# EAGLE design TSOC_USBUART2_test (EAGLE 6.6.0)
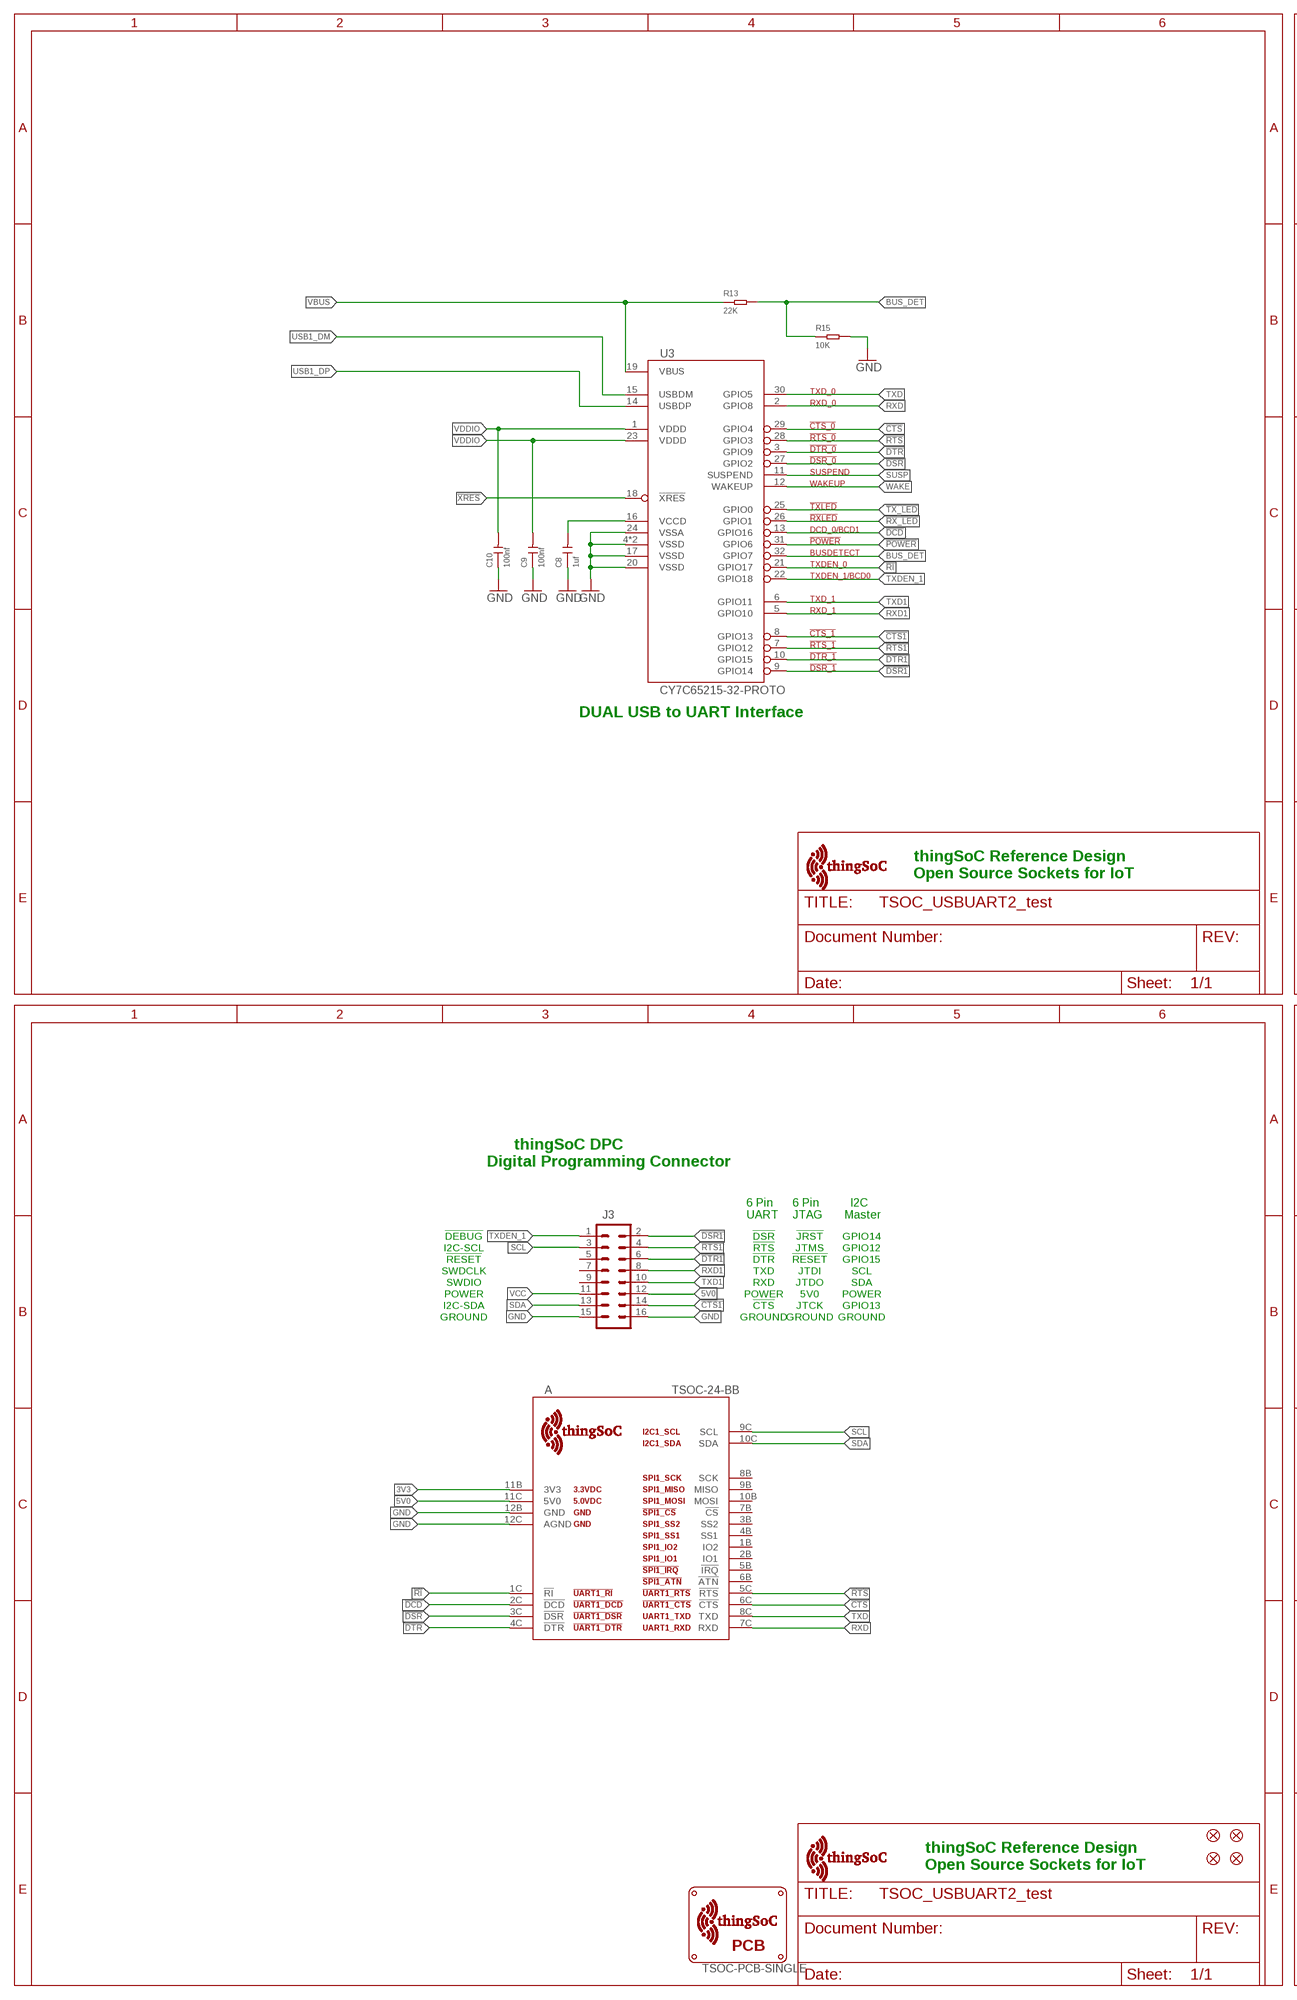
[diagram p0: schematic, sheet 1, part 1 of 2]
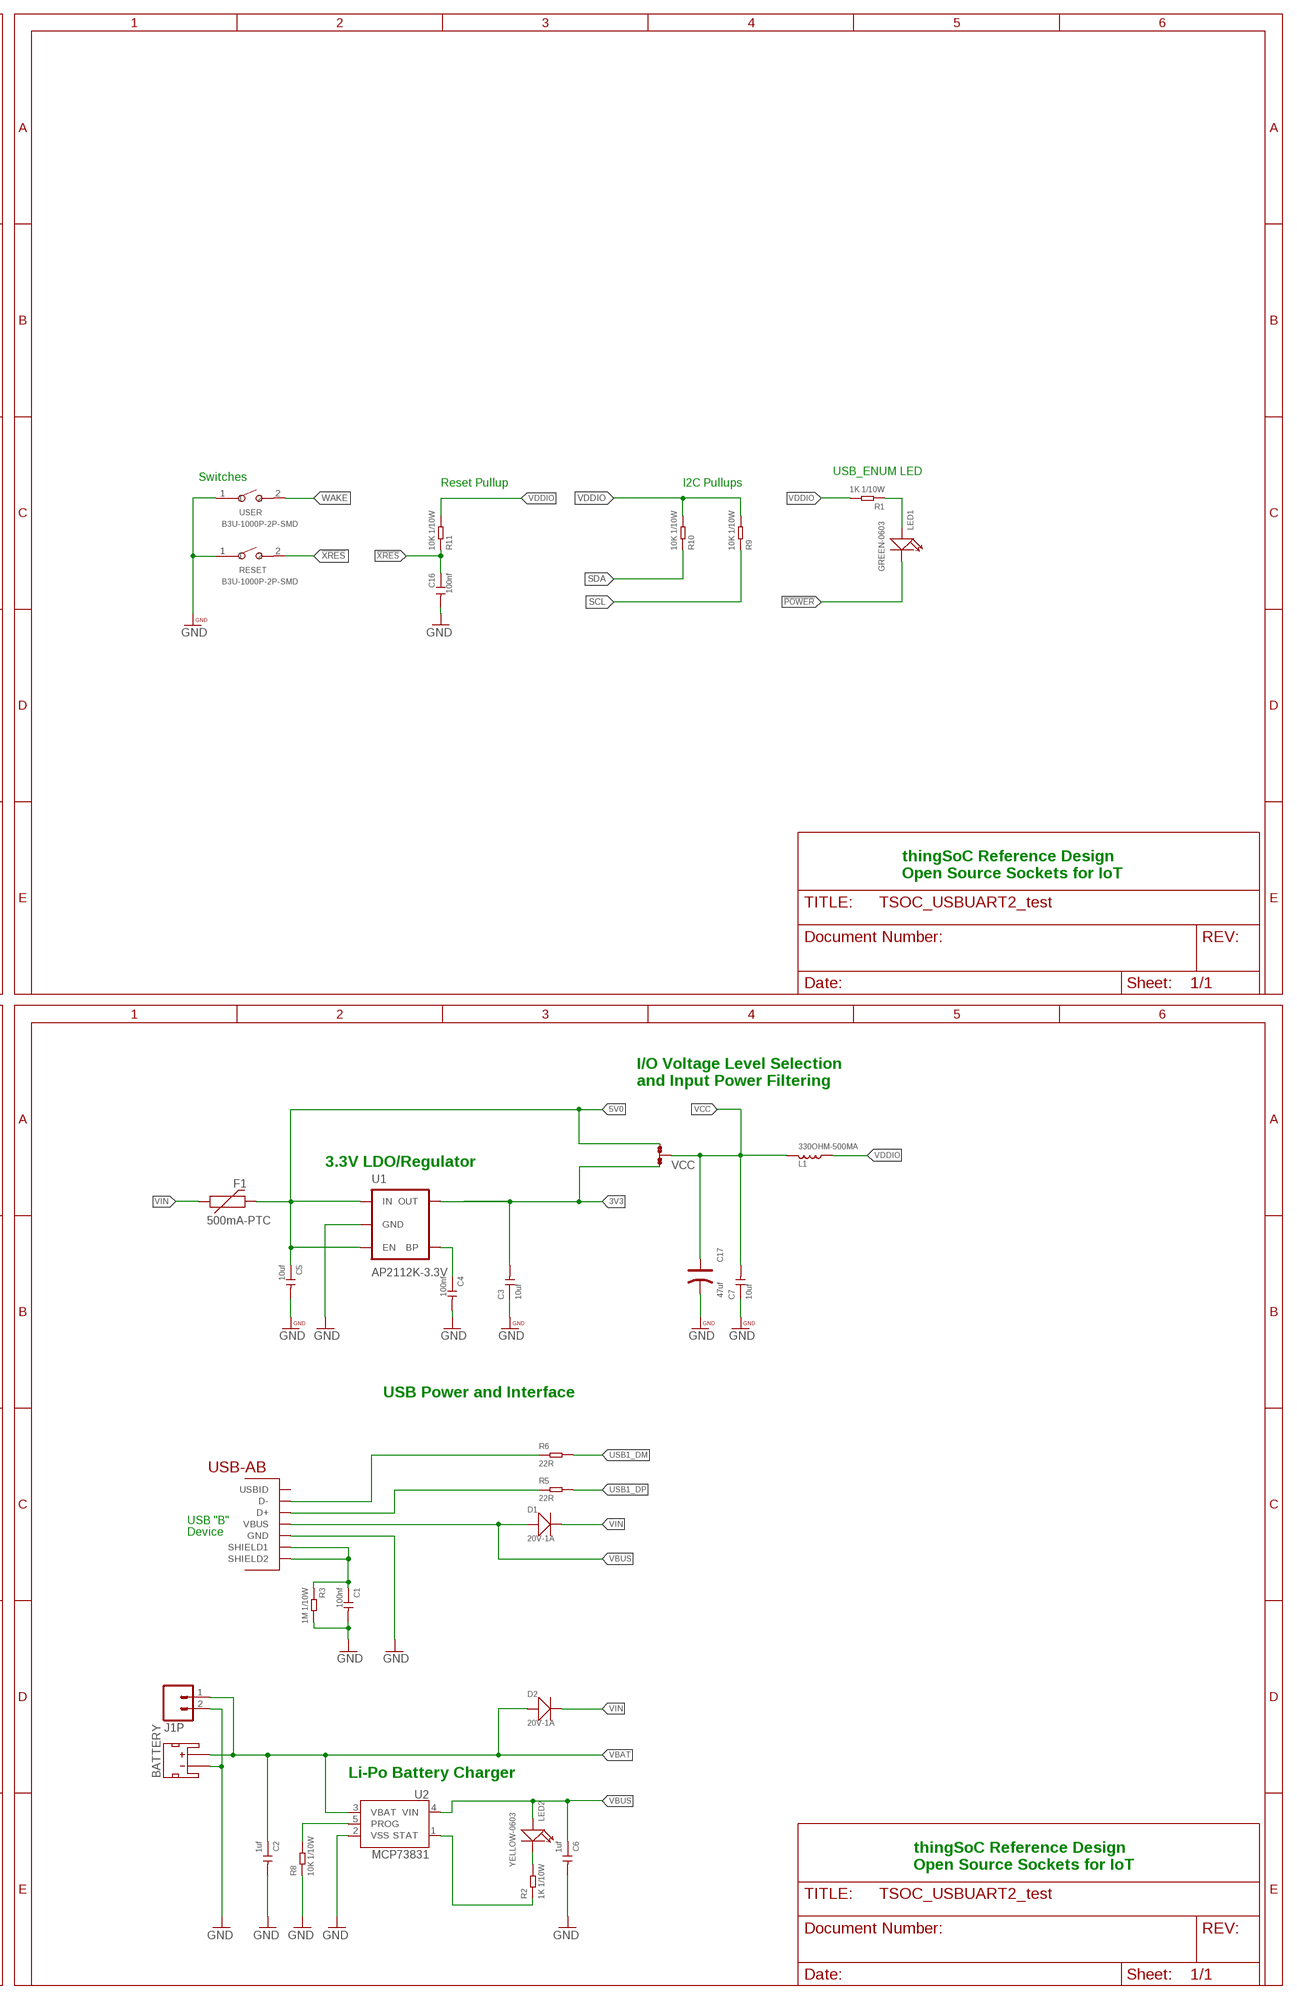
[diagram p1: schematic, sheet 1, part 2 of 2]

## Parts
A  TSOC-24-BB  [TSOC-BB-S24]
BATTERY  JST_2MM_MALE  [JST-2-SMD]
C1  100nf  CERAMIC-100NF-50V-10%-X7R(0603)  [C0603]
C2  1uf  CERAMIC-1UF-25V-10%-X7R(0603)  [C0603]
C3  10uf  CERAMIC-10UF-10V-10%-X5R(0603)  [C0603]
C4  100nf  CERAMIC-100NF-50V-10%-X7R(0603)  [C0603]
C5  10uf  CERAMIC-10UF-10V-10%-X5R(0603)  [C0603]
C6  1uf  CERAMIC-1UF-25V-10%-X7R(0603)  [C0603]
C7  10uf  CERAMIC-10UF-10V-10%-X5R(0603)  [C0603]
C8  1uf  CERAMIC-1UF-25V-10%-X7R(0603)  [C0603]
C9  100nf  CERAMIC-100NF-50V-10%-X7R(0603)  [C0603]
C10  100nf  CERAMIC-100NF-50V-10%-X7R(0603)  [C0603]
C16  100nf  CERAMIC-100NF-50V-10%-X7R(0603)  [C0603]
C17  47uf  TANTALUM-SMD-47UF-6.3V(AVX-A)  [AVX-A]
D1  20V-1A  SMD-DIODE-SCHOTTKY-20V-1A(SOD-123)  [SOD-123]
D2  20V-1A  SMD-DIODE-SCHOTTKY-20V-1A(SOD-123)  [SOD-123]
F1  500mA-PTC  PTCSMD  [PTC-1206]
FID1  FIDUCIALUFIDUCIAL  [MICRO-FIDUCIAL]
FID2  FIDUCIALUFIDUCIAL  [MICRO-FIDUCIAL]
FID3  FIDUCIALUFIDUCIAL  [MICRO-FIDUCIAL]
FID4  FIDUCIALUFIDUCIAL  [MICRO-FIDUCIAL]
J1P  M02-JST-2-PTH-NO_SILK  [JST-2-PTH-NS]
J3  M08X2  [2X8]
L1  330OHM-500MA  SMD-FERRITE-CHIP-120-OHM-500MA(0603)  [L0603]
LED1  GREEN-0603  SMD-LED-CLEAR-GREEN(0603)  [LED-0603]
LED2  YELLOW-0603  SMD-LED-CLEAR-YELLOW(0603)  [LED-0603]
R1  1K 1/10W  SMD-RES-1K-5%-1/10W(0603)  [R0603]
R2  1K 1/10W  SMD-RES-1K-5%-1/10W(0603)  [R0603]
R3  1M 1/10W  SMD-RES-1M-5%-1/10W(0603)  [R0603]
R5  22R  SMD-RES-22R-5%-1/10W(0603)  [R0603]
R6  22R  SMD-RES-22R-5%-1/10W(0603)  [R0603]
R8  10K 1/10W  SMD-RES-10K-5%-1/10W(0603)  [R0603]
R9  10K 1/10W  SMD-RES-10K-5%-1/10W(0603)  [R0603]
R10  10K 1/10W  SMD-RES-10K-5%-1/10W(0603)  [R0603]
R11  10K 1/10W  SMD-RES-10K-5%-1/10W(0603)  [R0603]
R13  22K  SMD-RES-22K-5%-1/10W(0603)  [R0603]
R15  10K  SMD-RES-10K-1%-1/10W(0603)  [R0603]
RESET  B3U-1000P-2P-SMD  SMD-BUTTON(2P-3.0X2.5X1.2+0.4MM)-B3U-1000P-2P-SMD  [SW2-2.6-3.0X2.5X1.2+0.4MM]
U1  AP2112K-3.3V  V_REG_LDOSMD  [SOT23-5]
U2  MCP73831  [SOT23-5]
U3  CY7C65215-32-PROTO  [QFN32-PROTO]
U$1  TSOC-PCB-SINGLE  [TSOC-BB-BRD-DIM]
U$100  TSOC-LOGO-LRG  [TSOC-LOGO-LRG]
U$101  TSOC-LOGO-SMALL  [TSOC-LOGO-SML]
USB  USB_AB  [USB-AB-MICRO-SMD]
USER  B3U-1000P-2P-SMD  SMD-BUTTON(2P-3.0X2.5X1.2+0.4MM)-B3U-1000P-2P-SMD  [SW2-2.6-3.0X2.5X1.2+0.4MM]
VCC  JMP-3-1_2  [JMP-3-1_2]

## Nets
3V3: A.11B(3V3) C3.2 U1.5(OUT) VCC.1
5V0: A.11C(5V0) C5.1 F1.2 J3.12 U1.1(IN) U1.3(EN) VCC.3
!CTS: A.6C(!CTS) U3.29(GPIO4)
!CTS1: J3.14 U3.8(GPIO13)
!DCD: A.2C(!DCD) U3.13(GPIO16)
!DSR: A.3C(!DSR) U3.27(GPIO2)
!DSR1: J3.2 U3.9(GPIO14)
!DTR: A.4C(!DTR) U3.3(GPIO9)
!DTR1: J3.6 U3.10(GPIO15)
!POWER: LED1.- U3.31(GPIO6)
!RI: A.1C(!RI) U3.21(GPIO17)
!RTS: A.5C(!RTS) U3.28(GPIO3)
!RTS1: J3.4 U3.7(GPIO12)
!RX_LED: U3.26(GPIO1)
!TX_LED: U3.25(GPIO0)
!XRES: C16.1 R11.1 RESET.2 U3.18(!XRES)
BUS_DET: R13.2 R15.1 U3.32(GPIO7)
BYPASS1: C4.1 U1.4(BP)
CLED: LED2.- R2.2
CSTAT: R2.1 U2.1(STAT)
GND: A.12B(GND) A.12C(AGND) BATTERY.1(-) C1.2 C2.2 C3.1 C4.2 C5.2 C6.2 C7.1 C8.1 C9.1 C10.1 C16.2 C17.- J1P.2 J3.15 J3.16 R3.2 R8.1 R15.2 RESET.1 U1.2(GND) U2.2(VSS) U3.4(VSSD) U3.17(VSSD) U3.20(VSSD) U3.24(VSSA) U3.EXP(VSSD) USB.GND USER.1
N$1: R8.2 U2.5(PROG)
N$17: LED1.+ R1.1
RXD: A.7C(RXD) U3.2(GPIO8)
RXD1: J3.8 U3.5(GPIO10)
SCL: A.9C(SCL) J3.3 R9.1
SDA: A.10C(SDA) J3.13 R10.1
SUSP: U3.11(SUSPEND)
TXD: A.8C(TXD) U3.30(GPIO5)
TXD1: J3.10 U3.6(GPIO11)
TXDEN_1: J3.1 U3.22(GPIO18)
USB1_DM: R6.2 U3.15(USBDM)
USB1_DP: R5.2 U3.14(USBDP)
USB1_M: R6.1 USB.D-
USB1_P: R5.1 USB.D+
USB1_SHIELD: C1.1 R3.1 USB.SHIELD1 USB.SHIELD2
VBAT: BATTERY.2(+) C2.1 D2.+ J1P.1 U2.3(VBAT)
VBUS: C6.1 D1.+ LED2.+ R13.1 U2.4(VIN) U3.19(VBUS) USB.VBUS
VCC: C7.2 C17.+ J3.11 L1.1 VCC.2
VCCD: C8.2 U3.16(VCCD)
VDDIO: C9.2 C10.2 L1.2 R1.2 R9.2 R10.2 R11.2 U3.1(VDDD) U3.23(VDDD)
VIN: D1.- D2.- F1.1
WAKE: U3.12(WAKEUP) USER.2
Unconnected: A.1B(IO2) A.2B(IO1) A.3B(SS2) A.4B(SS1) A.5B(!IRQ) A.6B(!ATN) A.7B(!CS) A.8B(SCK) A.9B(MISO) A.10B(MOSI) BATTERY.NC1(PAD1) BATTERY.NC2(PAD2) J3.5 J3.7 J3.9 USB.ID(USBID)

## Notes on the sheet
- USB_ENUM LED
- Switches
- Reset Pullup | I2C Pullups
- DUAL USB to UART Interface
- thingSoC Reference Design
  Open Source Sockets for IoT
- thingSoC Reference Design
  Open Source Sockets for IoT
- I/O Voltage Level Selection
  and Input Power Filtering
- thingSoC DPC
  Digital Programming Connector
- 3.3V LDO/Regulator
- 6 Pin
  UART
- 6 Pin
  JTAG
- I2C
  Master
- !DEBUG | !DSR | !JRST | GPIO14
- I2C-SCL | !RTS | JTMS | GPIO12
- !RESET | !DTR | !RESET | GPIO15
- SWDCLK | TXD | JTDI | SCL
- SWDIO | RXD | JTDO | SDA
- POWER | POWER | 5V0 | POWER
- I2C-SDA | !CTS | JTCK | GPIO13
- GROUND | GROUND | GROUND | GROUND
- USB Power and Interface
- USB "B"
- Device
- Li-Po Battery Charger
- thingSoC Reference Design
  Open Source Sockets for IoT
- thingSoC Reference Design
  Open Source Sockets for IoT

## Library data of the parts
A = thingSoC:TSOC-24: thingSoC Twenty-Four(24) Pin Socket Source LBR : http://www.thingsoc.com Github : https://github.com/thingsoc License : http://creativecommons.org/licenses/by-sa/4.0/ (Creative Commons 4.0) THIS SOFTWARE IS PROVIDED BY THE CONTRIBUTORS "AS IS" AND WITHOUT ANY EXPRESS OR IMPLIED WARRANTIES, INCLUDING, BUT NOT LIMITED TO, THE IMPLIED WARRANTIES OF MERCHANTABILITY AND FITNESS FOR A PARTICULAR PURPOSE ARE DISCLAIMED. IN NO EVENT SHALL THE COPYRIGHT OWNER OR CONTRIBUTORS BE LIABLE FOR ANY DIRECT, INDIRECT, INCIDENTAL, SPECIAL, EXEMPLARY, OR CONSEQUENTIAL DAMAGES (INCLUDING, BUT NOT LIMITED TO, PROCUREMENT OF SUBSTITUTE GOODS OR SERVICES; LOSS OF USE, DATA, OR PROFITS; OR BUSINESS INTERRUPTION) HOWEVER CAUSED AND ON ANY THEORY OF LIABILITY, WHETHER IN CONTRACT, STRICT LIABILITY, OR TORT (INCLUDING NEGLIGENCE OR OTHERWISE) ARISING IN ANY WAY OUT OF THE USE OF THIS SOFTWARE, EVEN IF ADVISED OF THE POSSIBILITY OF SUCH DAMAGE.
BATTERY = TSOC-ESP8266-BASE:JST_2MM_MALE: Mates to single-cell LiPo batteries. CONN-11443 Now with smashable polarity marks!; BTM_NEG: -; BTM_POS: +; PROD_ID: CONN-11443; TOP_NEG: -; TOP_POS: +
C1 C4 C9 C10 C16 = Seeed-Capacitor-2016:CERAMIC-100NF-50V-10%-X7R(0603): 302010138; MPN: CC0603KRX7R9BB104
C2 C6 C8 = Seeed-Capacitor-2016:CERAMIC-1UF-25V-10%-X7R(0603): 302010139; MPN: CC0603KRX7R8BB105
C3 C5 C7 = Seeed-Capacitor-2016:CERAMIC-10UF-10V-10%-X5R(0603): 302010103; MPN: CC0603KRX5R6BB106
C17 = Seeed-Capacitor-2016:TANTALUM-SMD-47UF-6.3V(AVX-A): 302020005; MPN: TAJA476*006#NJ
D1 D2 = Seeed-Diode-2016:SMD-DIODE-SCHOTTKY-20V-1A(SOD-123): 304020034; MPN: B5819W
F1 = SparkFun:PTC: Resettable Fuse PTC Resettable Fuse. Spark Fun Electronics SKU : COM-08357
FID1-FID4 = TSOC-ESP8266-BASE:FIDUCIAL: Fiducial Alignment Points Various fiducial points for machine vision alignment.
J1P = TSOC-ESP8266-BASE:M02: Standard 2-pin 0.1" header. Use with - straight break away headers ( PRT-00116) - right angle break away headers (PRT-00553) - swiss pins (PRT-00743) - machine pins (PRT-00117) - female headers (PRT-00115) Molex polarized connector foot print use with: PRT-08233 with associated crimp pins and housings. 2.54_SCREWTERM for use with PRT-10571. 3.5mm Screw Terminal footprints for PRT-08084 5mm Screw Terminal footprints for use with PRT-08432
J3 = PatternAgents-ProtoPads:M08X2: .1" headers, two rows of 8 each
L1 = Seeed-Inductor-2016:SMD-FERRITE-CHIP-120-OHM-500MA(0603): 303030001; MPN: BLM18AG121SN1D; VALUE: 120OHM-500MA
LED1 = Seeed-LED-2016:SMD-LED-CLEAR-GREEN(0603): 304090043; MPN: 19-217-G7C-AN1P2-3T
LED2 = Seeed-LED-2016:SMD-LED-CLEAR-YELLOW(0603): 304090044; MPN: 19-217-Y5C-AM1N1VY-3T
R1 R2 = Seeed-Resistor-2016:SMD-RES-1K-5%-1/10W(0603): 301010291; MPN: RC0603JR-071KL
R3 = Seeed-Resistor-2016:SMD-RES-1M-5%-1/10W(0603): 301010100; MPN: RC0603JR-071ML
R5 R6 = Seeed-Resistor-2016:SMD-RES-22R-5%-1/10W(0603): 301010289; MPN: RC0603JR-0722RL
R8-R11 = Seeed-Resistor-2016:SMD-RES-10K-5%-1/10W(0603): 301010293; MPN: RC0603JR-0710KL
R13 = Seeed-Resistor-2016:SMD-RES-22K-5%-1/10W(0603): 301010132; MPN: RC0603JR-0722KL
R15 = Seeed-Resistor-2016:SMD-RES-10K-1%-1/10W(0603): 301010299; MPN: RC0603FR-0710KL
RESET USER = Seeed-Switch-2016:SMD-BUTTON(2P-3.0X2.5X1.2+0.4MM): 311020047; MPN: B3U-1000P-2P-SMD
U1 = SparkFun-PowerIC:V_REG_LDO: Voltage Regulator LDO Standard 150mA LDO voltage regulator in SOT-23 layout. Micrel part MIC5205. BP (by-pass) pin is used to lower output noise with 470pF cap.; PROD_ID: VREG-12457
U2 = TSOC-ESP8266-BASE:MCP73831: Miniature single cell, fully integrated Li-Ion, Li-polymer charge management controller http://ww1.microchip.com/downloads/en/DeviceDoc/20001984g.pdf IC-09995; PROD_ID: IC-09995
U3 = PatternAgents-Cypress:CY7C65215-32: Cypress EZ-USB ® CY7C65215-32QFN DUAL CHANNEL USB TO UART/SPI/IC Bridge Full-Speed USB Peripheral Controller Source Data: http://www.cypress.com/?mpn=CY7C65211-24QFN LBR Source: http://www.patternagents.com THIS SOFTWARE IS PROVIDED BY THE CONTRIBUTORS "AS IS" AND WITHOUT ANY EXPRESS OR IMPLIED WARRANTIES, INCLUDING, BUT NOT LIMITED TO, THE IMPLIED WARRANTIES OF MERCHANTABILITY AND FITNESS FOR A PARTICULAR PURPOSE ARE DISCLAIMED. IN NO EVENT SHALL THE COPYRIGHT OWNER OR CONTRIBUTORS BE LIABLE FOR ANY DIRECT, INDIRECT, INCIDENTAL, SPECIAL, EXEMPLARY, OR CONSEQUENTIAL DAMAGES (INCLUDING, BUT NOT LIMITED TO, PROCUREMENT OF SUBSTITUTE GOODS OR SERVICES; LOSS OF USE, DATA, OR PROFITS; OR BUSINESS INTERRUPTION) HOWEVER CAUSED AND ON ANY THEORY OF LIABILITY, WHETHER IN CONTRACT, STRICT LIABILITY, OR TORT (INCLUDING NEGLIGENCE OR OTHERWISE) ARISING IN ANY WAY OUT OF THE USE OF THIS SOFTWARE, EVEN IF ADVISED OF THE POSSIBILITY OF SUCH DAMAGE.
U$1 = thingSoC:TSOC-PCB: thingSoC PCB Outlines Boards Outlines for Standard Sizes (in the DImension Layer) (Registration marks in the tDocu layer - make sure to turn on tDocu/bDocu) Source LBR : http://www.thingsoc.com Github : https://github.com/thingsoc License : http://creativecommons.org/licenses/by-sa/4.0/ (Creative Commons 4.0) THIS SOFTWARE IS PROVIDED BY THE CONTRIBUTORS "AS IS" AND WITHOUT ANY EXPRESS OR IMPLIED WARRANTIES, INCLUDING, BUT NOT LIMITED TO, THE IMPLIED WARRANTIES OF MERCHANTABILITY AND FITNESS FOR A PARTICULAR PURPOSE ARE DISCLAIMED. IN NO EVENT SHALL THE COPYRIGHT OWNER OR CONTRIBUTORS BE LIABLE FOR ANY DIRECT, INDIRECT, INCIDENTAL, SPECIAL, EXEMPLARY, OR CONSEQUENTIAL DAMAGES (INCLUDING, BUT NOT LIMITED TO, PROCUREMENT OF SUBSTITUTE GOODS OR SERVICES; LOSS OF USE, DATA, OR PROFITS; OR BUSINESS INTERRUPTION) HOWEVER CAUSED AND ON ANY THEORY OF LIABILITY, WHETHER IN CONTRACT, STRICT LIABILITY, OR TORT (INCLUDING NEGLIGENCE OR OTHERWISE) ARISING IN ANY WAY OUT OF THE USE OF THIS SOFTWARE, EVEN IF ADVISED OF THE POSSIBILITY OF SUCH DAMAGE.
U$100 U$101 = thingSoC:TSOC-LOGO: thingSoC Logo Source LBR : http://www.thingsoc.com Github : https://github.com/thingsoc License : http://creativecommons.org/licenses/by-sa/4.0/ (Creative Commons 4.0) THIS SOFTWARE IS PROVIDED BY THE CONTRIBUTORS "AS IS" AND WITHOUT ANY EXPRESS OR IMPLIED WARRANTIES, INCLUDING, BUT NOT LIMITED TO, THE IMPLIED WARRANTIES OF MERCHANTABILITY AND FITNESS FOR A PARTICULAR PURPOSE ARE DISCLAIMED. IN NO EVENT SHALL THE COPYRIGHT OWNER OR CONTRIBUTORS BE LIABLE FOR ANY DIRECT, INDIRECT, INCIDENTAL, SPECIAL, EXEMPLARY, OR CONSEQUENTIAL DAMAGES (INCLUDING, BUT NOT LIMITED TO, PROCUREMENT OF SUBSTITUTE GOODS OR SERVICES; LOSS OF USE, DATA, OR PROFITS; OR BUSINESS INTERRUPTION) HOWEVER CAUSED AND ON ANY THEORY OF LIABILITY, WHETHER IN CONTRACT, STRICT LIABILITY, OR TORT (INCLUDING NEGLIGENCE OR OTHERWISE) ARISING IN ANY WAY OUT OF THE USE OF THIS SOFTWARE, EVEN IF ADVISED OF THE POSSIBILITY OF SUCH DAMAGE.
USB = BeeSafe:USB_AB: This is a USB AB connector that is compatible with USB OTG. i.e. this connector can serve as a host or device
VCC = PatternAgents-ProtoPads:JMP-3-1_2: Three Terminal Jumper - 1 & 2 Connected Positions 1and 2 are normally connected. PatternAgents ProtoPads Library Schematic and PCB layout libraries for design patterns by PatternAgents. For the CADSoft Eagle CAD program : http://www.cadsoftusa.com/download-eagle/ Source LBR : http://www.patternagents.com Github : https://github.com/PatternAgents License : http://creativecommons.org/licenses/by-sa/4.0/ (Creative Commons 4.0) THIS SOFTWARE IS PROVIDED BY THE CONTRIBUTORS "AS IS" AND WITHOUT ANY EXPRESS OR IMPLIED WARRANTIES, INCLUDING, BUT NOT LIMITED TO, THE IMPLIED WARRANTIES OF MERCHANTABILITY AND FITNESS FOR A PARTICULAR PURPOSE ARE DISCLAIMED. IN NO EVENT SHALL THE COPYRIGHT OWNER OR CONTRIBUTORS BE LIABLE FOR ANY DIRECT, INDIRECT, INCIDENTAL, SPECIAL, EXEMPLARY, OR CONSEQUENTIAL DAMAGES (INCLUDING, BUT NOT LIMITED TO, PROCUREMENT OF SUBSTITUTE GOODS OR SERVICES; LOSS OF USE, DATA, OR PROFITS; OR BUSINESS INTERRUPTION) HOWEVER CAUSED AND ON ANY THEORY OF LIABILITY, WHETHER IN CONTRACT, STRICT LIABILITY, OR TORT (INCLUDING NEGLIGENCE OR OTHERWISE) ARISING IN ANY WAY OUT OF THE USE OF THIS SOFTWARE, EVEN IF ADVISED OF THE POSSIBILITY OF SUCH DAMAGE.; BOM: EXCLUDE

## Net classes
1 vcc: width 0.254 mm

## Board
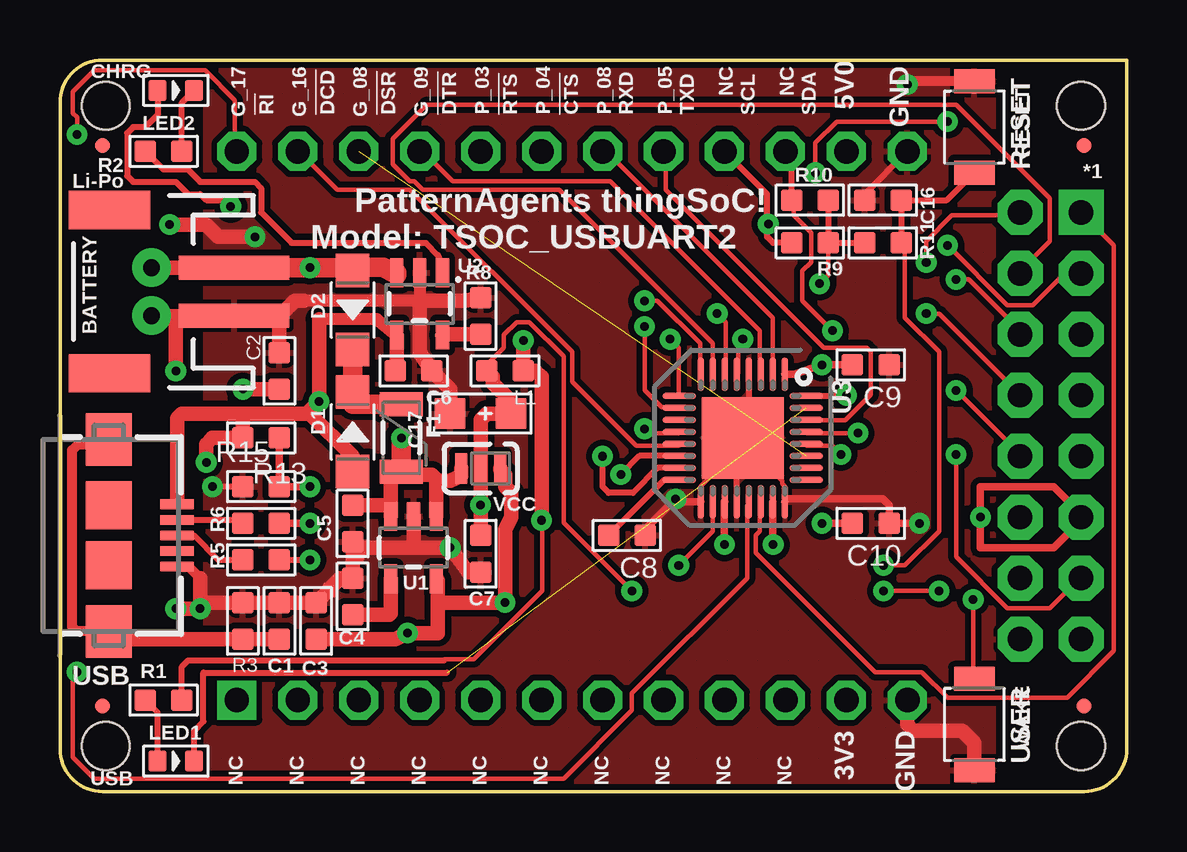
[diagram p2: board, top side]
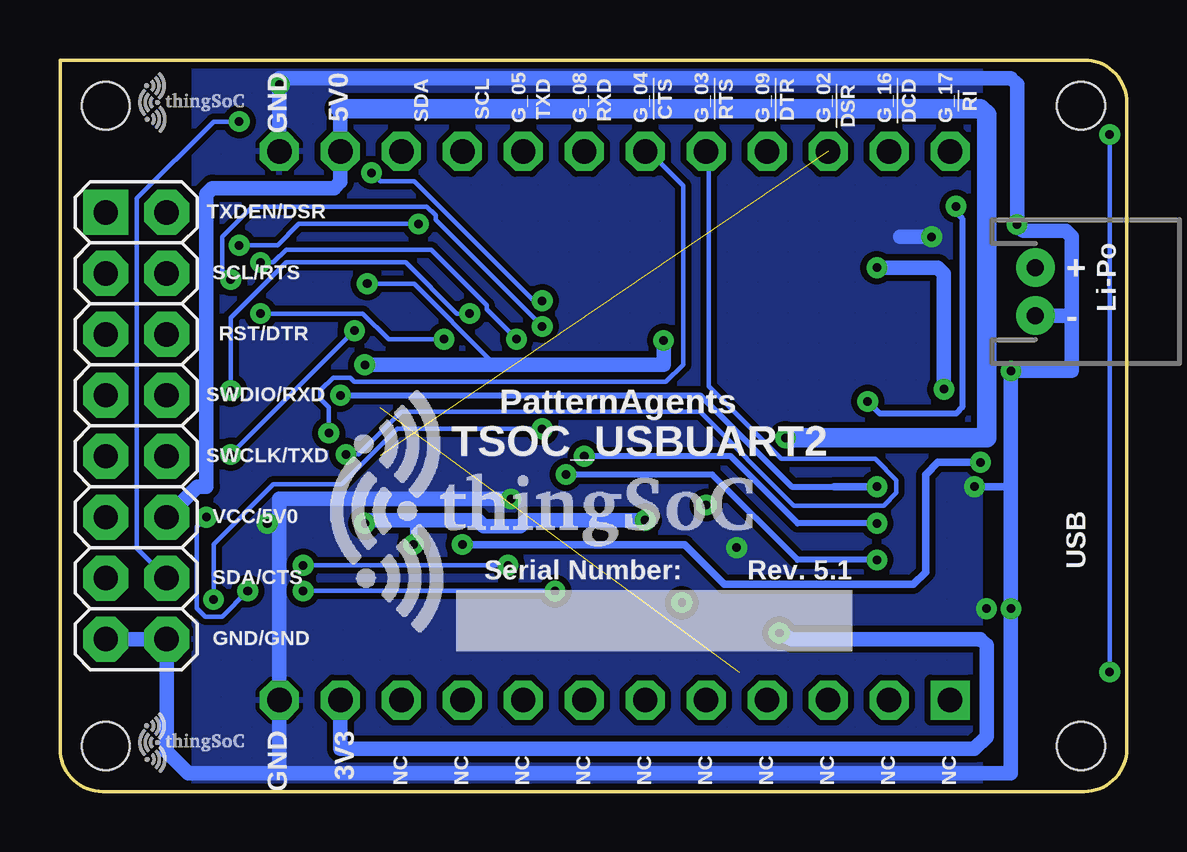
[diagram p3: board, bottom side, seen from below]

Size 44.45 x 30.48 mm. Coordinates in mm from the lower left corner, seen from the top.
Copper layers (1*16): Top 0.035mm / dielectric 1.5mm / Bottom 0.035mm
Design rules "PatternAgents_7mil": minimum track width 7mil, minimum drill 14mil, track to track 7mil, track to pad 7mil, pad to pad 7mil, via to via 7mil, smd to smd 7mil, copper to edge 7mil, drill to drill 7mil, minimum pad ring 12mil, minimum via ring 10mil, stop-mask expansion 4mil, vias tented up to drill 25mil, thermal gap 7mil

### Footprints (pad centres in the part's own frame; a part is rotated, then mirrored left to right if it is on the bottom)
TSOC-BB-S24 = drill 1.016 square: 1B -11.43,11.43 | drill 1.016 octagon: 1C 11.43,11.43; 2B -11.43,8.89; 2C 11.43,8.89; 3B -11.43,6.35; 3C 11.43,6.35; 4B -11.43,3.81; 4C 11.43,3.81; 5B -11.43,1.27; 5C 11.43,1.27; 6B -11.43,-1.27; 6C 11.43,-1.27; 7B -11.43,-3.81; 7C 11.43,-3.81; 8B -11.43,-6.35; 8C 11.43,-6.35; 9B -11.43,-8.89; 9C 11.43,-8.89; 10B -11.43,-11.43; 10C 11.43,-11.43; 11B -11.43,-13.97; 11C 11.43,-13.97; 12B -11.43,-16.51; 12C 11.43,-16.51
JST-2-SMD = smd 1 x 4.6: 1 -1,-3.7; 2 1,-3.7 | smd 1.6 x 3.4: NC1 -3.4,1.5; NC2 3.4,1.5
C0603 = smd 0.889 x 0.889: 1 0,0.762; 2 0,-0.762
AVX-A = smd 1.27 x 1.27: + -1.27,0; - 1.27,0
SOD-123 = smd 1.397 x 1.397: + -1.651,0; - 1.651,0
PTC-1206 = smd 1 x 1.8: 1 -1.4,0; 2 1.4,0
MICRO-FIDUCIAL = smd 0.635 x 0.635: 1 0,0
JST-2-PTH-NS = drill 0.7 pad 1.6: 1 -1,0; 2 1,0
2X8 = drill 1.016 pad 1.88 square: 1 0,0 | drill 1.016 pad 1.88 octagon: 2 0,2.54; 3 2.54,0; 4 2.54,2.54; 5 5.08,0; 6 5.08,2.54; 7 7.62,0; 8 7.62,2.54; 9 10.16,0; 10 10.16,2.54; 11 12.7,0; 12 12.7,2.54; 13 15.24,0; 14 15.24,2.54; 15 17.78,0; 16 17.78,2.54
L0603 = smd 0.889 x 0.889: 1 -0.762,0; 2 0.762,0
LED-0603 = smd 0.762 x 0.889: + -0.762,0; - 0.762,0
R0603 = smd 0.889 x 0.889: 1 0,0.762; 2 0,-0.762
SW2-2.6-3.0X2.5X1.2+0.4MM = smd 1 x 1.7: 1 -1.9,0; 2 1.9,0
SOT23-5 = smd 0.55 x 1.2: 1 -0.95,-1.3; 2 0,-1.3; 3 0.95,-1.3; 4 0.95,1.3; 5 -0.95,1.3
QFN32-PROTO = smd 1.4 x 0.254: 1 -2.65,1.75; 2 -2.65,1.25; 3 -2.65,0.75; 4 -2.65,0.25; 5 -2.65,-0.25; 6 -2.65,-0.75; 7 -2.65,-1.25; 8 -2.65,-1.75; 17 2.65,-1.75; 18 2.65,-1.25; 19 2.65,-0.75; 20 2.65,-0.25; 21 2.65,0.25; 22 2.65,0.75; 23 2.65,1.25; 24 2.65,1.75 | smd 0.254 x 1.4: 9 -1.75,-2.65; 10 -1.25,-2.65; 11 -0.75,-2.65; 12 -0.25,-2.65; 13 0.25,-2.65; 14 0.75,-2.65; 15 1.25,-2.65; 16 1.75,-2.65; 25 1.75,2.65; 26 1.25,2.65; 27 0.75,2.65; 28 0.25,2.65; 29 -0.25,2.65; 30 -0.75,2.65; 31 -1.25,2.65; 32 -1.75,2.65 | smd 3.4 x 3.4: EXP 0,0
TSOC-BB-BRD-DIM = hole 2: 13.335,16.891; -13.335,16.891; 13.335,-23.749; -13.335,-23.749
USB-AB-MICRO-SMD = smd 1.4 x 0.4: D+ 2.85,0; D- 2.85,0.65; GND 2.85,-1.3; ID 2.85,-0.65; VBUS 2.85,1.3 | smd 1.9 x 2: P$6 0,1.25; P$7 0,-1.25 | smd 1.9 x 2.2: SHIELD1 0,4; SHIELD2 0,-4
JMP-3-1_2 = smd 0.508 x 1.27: 1 -0.813,0; 2 0,0; 3 0.813,0

### Placement (x,y rotation side)
A  18.8,15.24 90 top
BATTERY  3.56,20.83 90 top
C1  9.14,7.11 180 top
C2  9.14,17.53 180 top
C3  10.67,7.11 0 top
C4  12.19,8.13 180 top
C5  12.19,11.18 0 top
C6  14.73,17.53 90 top
C7  17.53,9.91 180 top
C8  23.62,10.67 270 top
C9  33.78,17.78 270 top
C10  33.78,11.18 270 top
C16  34.29,24.64 270 top
C17  17.53,15.75 180 top
D1  12.19,14.99 90 top
D2  12.19,20.07 270 top
F1  14.22,14.73 270 top
FID1  1.78,3.56 180 top
FID2  1.78,26.92 180 top
FID3  42.67,3.56 180 top
FID4  42.67,26.92 180 top
J1P  3.81,20.83 270 bottom
J3  42.55,24.13 270 bottom
L1  18.54,17.53 0 top
LED1  4.83,1.27 0 top
LED2  4.83,29.21 0 top
R1  4.32,3.81 90 top
R2  4.32,26.67 90 top
R3  7.62,7.11 180 top
R5  8.38,9.65 90 top
R6  8.38,11.18 90 top
R8  17.53,19.81 0 top
R9  31.24,22.86 90 top
R10  31.24,24.64 90 top
R11  34.29,22.86 270 top
R13  8.38,14.73 90 top
R15  8.38,12.7 270 top
RESET  38.1,27.69 270 top
U1  14.73,10.16 180 top
U2  14.99,20.32 180 top
U3  28.45,14.73 270 top
U$1  18.8,15.24 90 top
U$100  29.97,11.68 0 bottom
U$101  40.39,2.03 0 bottom
U$102  TSOC-LOGO-SMALL  [TSOC-LOGO-SML]  40.39,28.7 0 bottom
USB  2.03,10.67 0 top
USER  38.1,2.79 90 top
VCC  17.53,13.46 180 top

### Tracks (layer width: path | path; a pad name or v marks a point on that pad's centre or on a via)
3V3  (via drill 0.36)
  Top 0.178: U1.5 15.65,8.89 15.75,8.79
  Top 0.61: C3.2 13.97,6.35 v14.48,6.6 15.75,6.6 15.75,7.87 | VCC.1 18.34,13.41 18.54,13.21 18.54,12.7 18.8,12.45 18.8,11.43 18.54,10.92 v18.54,7.87 15.75,7.87 | 15.75,8.79 15.75,7.87
  Bottom 0.61: v14.48,6.6 13.97,6.35 6.1,6.35 5.84,6.1 5.84,2.29 6.35,1.78 32.77,1.78 A.11B
5V0  (via drill 0.36)
  Top 0.61: C5.1 13.75,11.94 U1.3 13.78,13.14 F1.2 13.84,13.21 15.49,13.21 15.68,13.02 | U1.1 15.68,13.02 | VCC.3 16.71,13.16 16.26,12.95 15.75,12.95 15.68,13.02
  Top 0.813: F1.2 v14.22,14.73
  Bottom 0.61: 32.77,28.45 A.11C 32.77,25.4 33.02,25.15 38.1,25.15 38.35,24.89 38.35,12.7 38.73,12.7 J3.12
  Bottom 0.813: v14.22,14.73 5.84,14.73 5.84,28.19 6.1,28.45 32.77,28.45
!CTS  (via drill 0.36)
  Top 0.178: v33.25,14.94 31.11,14.94 U3.29
  Bottom 0.178: v33.25,14.94 33.25,16 33.6,16.36 33.6,16.71 33.07,17.25 32.36,17.25 32.18,17.07 19.2,17.07 18.49,17.78 18.49,25.25 19.91,26.67 A.6C
!CTS1  (via drill 0.36)
  Top 0.178: v24.36,20.45 24.89,20.45 26.67,18.67 26.67,17.42 U3.8 | v31.47,25.78 31.47,27.03 32.36,27.91 v36.98,27.91
  Bottom 0.178: v24.36,20.45 24.71,20.45 29.69,25.43 31.11,25.43 v31.47,25.78 | v36.98,27.91 38.05,27.91 41.25,24.71 41.25,10.13 J3.14
!DCD
  Top 0.178: U3.13 25.78,14.4 24,14.4 21.34,17.07 21.34,18.31 14.58,25.07 11.56,25.07 9.96,26.67 A.2C
!DSR  (1 unrouted)
!DSR1  (via drill 0.36)
  Top 0.178: v25.43,18.85 25.78,18.49 25.78,16.54 U3.9 | v36.09,22.05 36.09,22.94 37.16,24 40.01,24 J3.2
  Bottom 0.178: v25.43,18.85 26.67,20.09 26.67,20.27 28.98,22.58 35.03,22.58 35.56,22.05 v36.09,22.05
!DTR
  Top 0.178: U3.3 29.16,17.42 29.16,19.2 22.94,25.43 16.36,25.43 15.11,26.67 A.4C
!DTR1  (via drill 0.36)
  Top 0.178: v24.36,19.38 24.36,16.71 25.07,16 25.78,16 U3.10 | v37.34,21.34 37.87,21.34 40.01,19.2 J3.6
  Bottom 0.178: v24.36,19.38 28.8,23.82 28.8,24 29.16,24.36 36.45,24.36 37.69,23.11 37.69,21.69 v37.34,21.34
!POWER  (1 unrouted)
  Top 0.254: LED1.- 5.59,2.54 5.97,2.92 5.97,4.95 16.13,4.95
!RI  (via drill 0.36)
  Top 0.178: v0.71,4.98 0.53,4.8 0.53,1.42 1.42,0.53 20.98,0.53 23.82,3.38 23.82,4.09 28.63,8.89 28.63,11.91 U3.21 | v0.71,27.38 0.71,28.09 0.53,28.27 0.53,29.16 1.42,30.05 6.04,30.05 7.29,28.8 7.29,26.67 A.1C
  Bottom 0.178: v0.71,27.38 v0.71,4.98
!RTS  (via drill 0.36)
  Top 0.178: v32.54,14.05 32.18,14.4 31.11,14.4 U3.28
  Bottom 0.178: v32.54,14.05 32,14.05 30.23,15.82 17.78,15.82 13.87,11.91 10.13,11.91 9.6,12.45 9.6,12.98 10.49,13.87 14.4,13.87 17.42,16.89 17.42,26.67 A.5C
!RTS1
  Top 0.178: U3.7 27.2,17.42 27.2,18.67 20.8,25.07 15.11,25.07 14.76,25.43 14.58,25.43 13.87,26.14 13.87,27.2 15.29,28.63 37.34,28.63 41.25,24.71 41.25,22.94 40.01,21.69 J3.4
!XRES  (via drill 0.36)
  Top 0.178: v25.78,9.42 27.2,10.85 27.2,11.91 U3.18 | v34.31,9.42 35.2,9.42 36.63,10.85 36.63,18.31 35.2,19.74 35.2,22.76 R11.1
  Top 0.254: RESET.2 36.95,24.64 C16.1 R11.1
  Bottom 0.178: v34.31,9.42 v25.78,9.42
BUS_DET  (via drill 0.36)
  Top 0.254: U3.32 32.74,16.48 v32.77,16.51
  Top 0.305: v10.41,12.7 R15.1 R13.2
  Bottom 0.254: v32.77,16.51 17.78,16.51 13.97,12.7 12.19,12.7
  Bottom 0.305: v10.41,12.7 12.19,12.7
BYPASS1
  Top 0.61: U1.4 13.78,7.43 13.72,7.37 C4.1
CLED
  Top 0.254: R2.2 5.08,28.7 LED2.-
CSTAT
  Top 0.254: U2.1 16,21.69 15.75,22.35 15.24,22.86 9.65,22.86 8.38,24.13 8.38,25.15 8.13,25.4 5.84,25.4 5.33,25.91 4.32,25.91 R2.1
GND  (via drill 0.36)
  Top 0.178: 26.7,12.73 27.69,13.72 27.82,13.72 28.2,14.1 | U3.24 30.2,12.73 30.1,12.83 30.1,12.95 29.97,13.08 29.97,13.21 U3.EXP 28.27,13.51 28.2,13.46 | 12.62,9.78 12.58,9.66 | 11.02,7.82 C3.1 | C5.2 12.45,10.31 12.45,10.32 | 11.38,8.18 11.42,8.18 | 11.02,8.53 11.06,8.62
  Top 0.254: R15.2 v6.35,12.7 | C16.2 33.53,24.89 A.12C | U3.20 28.2,13.46 28.2,14.1 28.2,14.48 U3.EXP 28.7,14.99 28.7,15.24 U3.4
  Top 0.305: 28.2,13.46 28.19,13.46 | C8.1 24.38,10.92 v25.65,12.19 25.76,12.08 U3.17 | U3.24 30.31,12.19 34.29,12.19 34.54,11.94 C10.1 v35.81,11.18
  Top 0.406: USB.GND 5.36,9.37 5.84,8.89 | RESET.1 35.43,29.59 v35.31,29.46
  Top 0.508: U2.2 14.99,20.45 10.16,20.45
  Top 0.61: 5.84,8.89 v5.84,7.62 | 9.14,19.81 7.27,19.81 BATTERY.1 7.24,19.81 4.83,19.81 | C2.2 9.14,19.81 | R8.1 16.89,20.45 14.99,20.45 14.99,18.29 C6.2 16.26,16.76 C17.- | 4.83,19.81 v4.83,17.53 | 4.83,19.81 3.83,19.81 J1P.2 | v5.84,7.62 v4.83,7.62 | 14.73,10.16 U1.2 | USER.1 38.1,2.03 37.59,2.54 35.56,2.54 35.31,2.79 A.12B | 10.16,20.45 9.78,20.45 9.14,19.81 | 14.73,10.16 v16.26,10.16 17.02,9.14 C7.1 | 14.73,10.16 12.45,10.16 C5.2 C4.2 11.68,8.89 C3.1 C1.2 R3.2 6.1,7.87 v5.84,7.62 | v4.57,23.62 6.1,23.62 6.6,23.11 v8.13,23.11
  Bottom 0.305: v6.35,12.7 4.83,12.7
  Bottom 0.61: 35.31,0.76 39.12,0.76 40.01,1.65 J3.16 J3.15 | 35.31,0.76 4.83,0.76 v4.83,7.62 4.83,12.7 v4.83,17.53 2.29,17.53 2.29,19.81 | A.12C v35.31,29.46 35.31,29.72 4.83,29.72 4.57,29.46 v4.57,23.62 4.32,23.37 2.54,23.37 2.29,23.11 2.29,19.81 | v8.13,23.11 9.45,23.11 | J1P.2 2.3,19.83 2.29,19.81 | 35.31,0.76 A.12B 35.31,12.19 v25.65,12.19
  pour Top (isolate 0.254, hatched): 38.86,30.48 38.86,0 6.1,0 6.1,30.48
  pour Bottom (isolate 0.254, hatched): 38.86,30.48 38.86,0 6.1,0 6.1,30.48
N$1
  Top 0.61: R8.2 15.97,19.05 U2.5
N$17
  Top 0.254: LED1.+ 4.06,3.3 R1.1
RXD
  Top 0.178: U3.2 29.69,17.42 29.69,19.74 22.76,26.67 A.7C
RXD1  (via drill 0.36)
  Top 0.178: v28.45,18.85 28.27,18.67 28.27,17.42 U3.5 | v36.09,19.91 36.63,19.91 40.01,16.54 J3.8
  Bottom 0.178: v28.45,18.85 30.76,18.85 31.83,19.91 v36.09,19.91
SCL  (via drill 0.36)
  Top 0.178: v36.98,22.76 39.47,20.27 40.54,20.27 41.78,21.51 42.49,21.51 J3.3 | v29.52,23.65 29.46,23.65
  Top 0.254: R9.1 29.72,22.86 29.46,23.11 29.46,23.65 29.46,24.89 A.9C
  Bottom 0.178: v36.98,22.76 35.38,22.76 34.49,23.65 v29.52,23.65
SDA  (via drill 0.36)
  Top 0.178: v32.18,19.2 30.94,20.45 30.94,21.69 31.29,22.05 31.29,23.29 30.58,24 30.58,24.54 R10.1 | v37.34,14.05 37.34,9.78 39.47,7.64 41.25,7.64 42.49,8.89 J3.13
  Top 0.254: R10.1 30.48,26.42 A.10C
  Bottom 0.178: v37.34,14.05 v32.18,19.2
TXD
  Top 0.178: U3.30 31.11,15.47 32.72,15.47 33.78,16.54 33.78,18.31 33.6,18.49 31.83,18.49 25.25,25.07 25.25,26.67 A.8C
TXD1  (via drill 0.36)
  Top 0.178: v27.38,19.91 27.74,19.56 27.74,17.42 U3.6 | v37.34,16.71 40.01,14.05 J3.10
  Bottom 0.178: v27.38,19.91 27.91,19.91 30.05,22.05 35.03,22.05 37.34,19.74 v37.34,16.71
TXDEN_1
  Top 0.178: J3.1 43.92,22.76 43.92,5.87 41.96,3.91 36.98,3.91 35.92,4.98 33.96,4.98 28.98,9.96 28.98,10.67 29.16,10.85 29.16,11.91 U3.22
USB1_DM  (via drill 0.36)
  Top 0.254: U3.15 24.91,13.48 23.88,12.45 22.86,12.45 22.61,12.7 v22.61,13.97
  Top 0.305: R6.2 v10.41,11.18
  Bottom 0.254: v10.41,11.18 13.72,11.18 16.51,13.97 v22.61,13.97
USB1_DP  (via drill 0.36)
  Top 0.254: R5.2 v10.41,9.65 | 25.79,13.97 U3.14 24.14,13.98 v23.37,13.21
  Bottom 0.254: v10.41,9.65 13.72,9.65 17.27,13.21 v23.37,13.21
USB1_M
  Top 0.254: USB.D- 7.48,11.32 R6.1
USB1_P
  Top 0.254: USB.D+ 5.59,10.67 6.6,9.65 R5.1
USB1_SHIELD
  Top 0.406: USB.SHIELD2 0.7,6.67 0.51,6.86 0.51,14.22 0.76,14.48 1.84,14.48
  Top 0.61: C1.1 R3.1 2.35,6.35 USB.SHIELD2 2.6,6.1 | 1.84,14.48 USB.SHIELD1
VBAT  (via drill 0.36)
  Top 0.61: C2.1 v7.62,16.76 | BATTERY.2 J1P.1
  Top 0.813: BATTERY.2 v10.41,21.83 11.57,21.83 D2.+ 12.32,21.84 13.46,21.84 14.04,21.52 U2.3
  Bottom 0.61: v7.62,16.76 7.62,21.57 7.87,21.83 v10.41,21.83
VBUS  (via drill 0.36)
  Top 0.178: USB.VBUS 4.98,11.91 4.88,12.19
  Top 0.254: LED2.+ 4.06,28.19 3.56,27.69 3.05,27.69 2.79,27.43 2.79,25.65 3.05,25.4 4.83,25.4 5.33,24.89 5.84,24.89 6.1,24.64 6.86,24.64 v7.11,24.38
  Top 0.305: v27.69,10.29 27.69,12.07 U3.19
  Top 0.508: U2.4 14,19.02 13.21,19.68 10.79,19.68
  Top 0.61: 10.79,19.68 v10.79,16.26 10.35,15.81 | U2.4 14.04,17.71 C6.1 | 4.88,12.19 4.88,15.55 5.08,15.75 7.62,15.75 | 7.62,15.75 10.29,15.75 10.35,15.81 | D1.+ 12.19,13.97 10.35,15.81 | v6.1,13.72 6.1,14.48 6.35,14.73 R13.1 7.62,15.75
  Bottom 0.254: v7.11,24.38 7.11,24.13 6.86,23.88 6.86,16 7.11,15.75 10.29,15.75 v10.79,16.26
  Bottom 0.305: v6.1,13.72 7.87,13.72 8.38,13.21 8.38,9.14 8.89,8.64 16.76,8.64 18.41,10.29 v27.69,10.29
VCC  (via drill 0.36)
  Top 0.178: 17.42,10.77 C7.2 | v23.82,8.36 20.98,11.2 20.98,18.14 19.56,19.56 19.02,19.56 18.49,19.02 18.49,18.49 17.78,17.78 L1.1 | v36.63,8.36 v34.31,8.36
  Top 0.305: J3.11 42.55,11.3 41.4,10.16 38.35,10.16 v38.35,11.43 38.35,12.7 41.4,12.7 42.67,11.43
  Top 0.61: C7.2 v17.53,11.94 VCC.2 17.53,15.49 17.78,15.75 C17.+ 18.8,16.26 18.03,17.02 18.03,17.27 L1.1
  Bottom 0.178: v34.31,8.36 v23.82,8.36 | v36.63,8.36 37.69,7.29 38.41,7.29 38.76,7.64 38.76,11.02 v38.35,11.43
VCCD
  Top 0.254: U3.16 25.17,12.98 C8.2
  Top 0.305: 22.99,10.79 C8.2
VDDIO  (via drill 0.36)
  Top 0.178: R9.2 32,21.51 v31.65,21.16 | 16,5.46 16,5.51 17.25,5.51 20.09,8.36 20.09,11.02 v20.07,11.3
  Top 0.254: R10.2 R9.2 R11.2 | R1.2 5.08,5.21 5.33,5.46 16,5.46
  Top 0.305: C9.2 v31.75,17.78 30.59,17.38 U3.1 | C10.2 v31.75,11.18 | U3.23 29.7,10.94 v29.72,10.29
  Top 0.61: v19.3,18.8 L1.2 19.81,17.53 20.07,17.27 v20.07,11.3
  Bottom 0.178: v31.65,21.16 29.69,21.16 26.49,17.96 26.49,17.78 | 29.87,11.3 29.87,11.38 29.57,11.3
  Bottom 0.305: v29.72,10.29 29.72,11.3
  Bottom 0.61: v19.3,18.8 19.3,17.78 26.49,17.78 v31.75,17.78 | v20.07,11.3 25.02,11.3 25.27,11.05 26.8,11.05 27.05,11.3 29.57,11.3 | 29.72,11.3 29.87,11.3 31.62,11.3 v31.75,11.18
VIN
  Top 0.813: F1.1 12.19,16.13 D1.- D2.-
WAKE  (via drill 0.36)
  Top 0.178: v24.36,15.11 24.54,14.94 25.78,14.94 U3.12 | v38.05,8 38.05,4.8 USER.2
  Bottom 0.178: v24.36,15.11 30.4,15.11 32.72,12.8 35.56,12.8 38.05,10.31 v38.05,8

### Text on the board
tPlace: CHRG | G_17 | G_16 | G_08 | G_09 | P_03 | P_04 | P_08 | P_05 | NC | NC | 5V0 | GND | !RI | !DCD | !DSR | !DTR | !RTS | !CTS | RXD | TXD | SCL | SDA | RESET | *1 | Li-Po | PatternAgents thingSoC! | Model: TSOC_USBUART2 | 3V3 | GND | WAKE | USB | NC | NC | NC | NC | NC | NC | NC | NC | NC | NC
bPlace: G_17 | !DCD | G_16 | G_02 | !DTR | G_09 | !RTS | G_03 | !CTS | G_04 | RXD | G_08 | TXD | G_05 | SCL | SDA | 5V0 | GND | !RI | !DSR | TXDEN/DSR | Li-Po | + | SCL/RTS | - | RST/DTR | PatternAgents | SWDIO/RXD | TSOC_USBUART2 | SWCLK/TXD | USB | VCC/5V0 | Rev. 5.1 | Serial Number: | SDA/CTS | GND/GND | 3V3 | GND | NC | NC | NC | NC | NC | NC | NC | NC | NC | NC